# Altium project bmc-27.PrjPcb
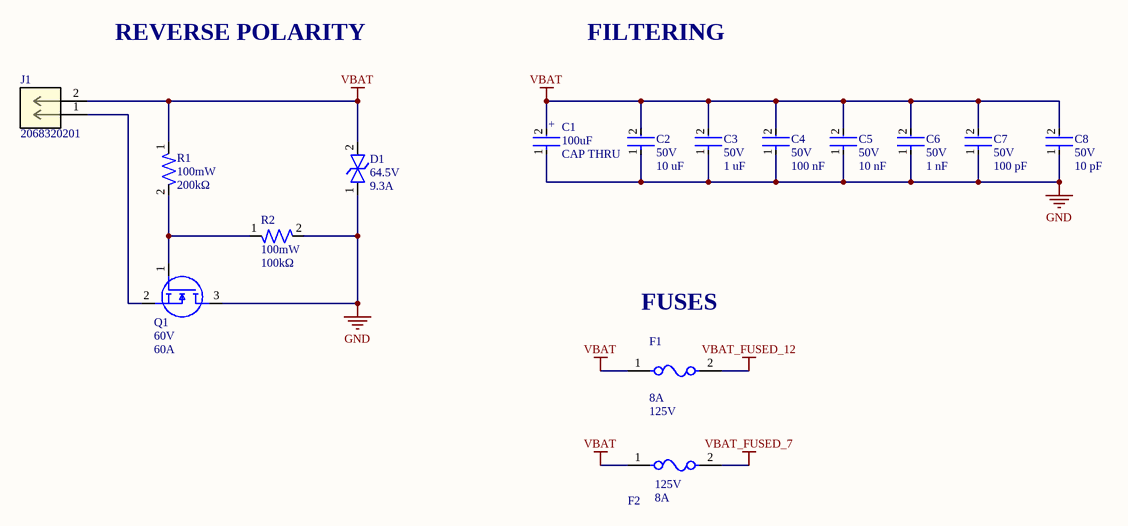
[diagram p0: Input Power.SchDoc]
7 sheets, 184 parts. Net scope: flat (ports and power ports of the same name join across sheets).
Sheets:
  Input Power.SchDoc
  Motor Control.SchDoc
  12V Buck.SchDoc
  7V Buck.SchDoc
  LDOs.SchDoc
  MCU.SchDoc
  CAN.SchDoc

## Sheet Input Power.SchDoc
size A; SheetNumber: 1; SheetTotal: 5

### Parts
C1  CAP THRU  value 100uF  [WCAP-ATUL_8X11.5(DXL)]
C2  Voltage Rating: 50V  Capacitance: 10 uF  [CAP-1210]  (hidden comment: CAP 1210)
C3  Voltage Rating: 50V  Capacitance: 1 uF  [CAP-1210]  (hidden comment: CAP 1210)
C4  Voltage Rating: 50V  Capacitance: 100 nF  [CAP-1210]  (hidden comment: CAP 1210)
C5  Voltage Rating: 50V  Capacitance: 10 nF  [CAP-1210]  (hidden comment: CAP 1210)
C6  Voltage Rating: 50V  Capacitance: 1 nF  [CAP-1210]  (hidden comment: CAP 1210)
C7  Voltage Rating: 50V  Capacitance: 100 pF  [CAP-1210]  (hidden comment: CAP 1210)
C8  Voltage Rating: 50V  Capacitance: 10 pF  [CAP-1210]  (hidden comment: CAP 1210)
D1  Voltage Rating: 64.5V  Current Rating: 9.3A  [DO-214AA (SMBJ)]  (hidden comment: SMBJ40CA)
F1  Fuse Current: 8A  Voltage Rating: 125V  [FUSE-0001]  (hidden comment: 01550900M)
F2  Fuse Current: 8A  Voltage Rating: 125V  [FUSE-0001]  (hidden comment: 01550900M)
J1  2068320201  [CONN_2068320000-SD_02_MOL]
Q1  Voltage: 60V  Continuous Current: 60A  [IC-8VSONCLIP]  (hidden comment: CSD18543Q3AT)
R1  Wattage: 100mW  Resistance: 200kΩ  [RES-0805]  (hidden comment: RES 0805)
R2  Wattage: 100mW  Resistance: 100kΩ  [RES-0805]  (hidden comment: RES 0805)

### Nets
GND: C1.1 C2.1 C3.1 C4.1 C5.1 C6.1 C7.1 C8.1 D1.1 Q1.3(D) R2.2
VBAT: C1.2 C2.2 C3.2 C4.2 C5.2 C6.2 C7.2 C8.2 D1.2 F1.1 F2.1 J1.2 R1.1
VBAT_FUSED_7: F2.2
VBAT_FUSED_12: F1.2
NetJ1_1: J1.1 Q1.2(S)
NetQ1_1: Q1.1(G) R1.2 R2.1

### Notes on the sheet
- REVERSE POLARITY
- FILTERING
- FUSES
- (in symbol CAP THRU) +

### Library data of the parts
C1 = CAP THRU: MF: {'manufacturer': u'W\xfcrth Elektronik'}; MP: 860040674004; Package: None; Price: None; Availability: Unavailable
D1 = DIO-TVS-0001: TVS DIODE 40VWM 64.5VC DO214AA; ComponentLink1Description: Datasheet; ComponentLink1URL: https://www.littelfuse.com/media?resourcetype=datasheets&itemid=09a6ae9a-73cb-4ac4-acac-e6dab92ab953&filename=littelfuse_tvs_diode_smbj_datasheet.pdf
F1 = FUSE-0001: FUSE BLOK CARTRIDGE 125V 10A SMD; ComponentLink2Description: Datasheet; ComponentLink2URL: https://www.littelfuse.com/~/media/electronics/datasheets/fuses/littelfuse_fuse_154_154t_154l_154tl_datasheet.pdf.pdf
F2 = CMP-08604-000021-1: FUSE BLOK CARTRIDGE 125V 10A SMD; ComponentLink2Description: Datasheet; ComponentLink2URL: https://www.littelfuse.com/~/media/electronics/datasheets/fuses/littelfuse_fuse_154_154t_154l_154tl_datasheet.pdf.pdf
J1 = CONN MF+ 2 PIN VERT: Micro-Fit+ Vertical Header, Through Hole, 3.00mm Pitch, Dual Row, 2 Circuits, Tin (Sn) Plating, Glow-Wire Capable, Black, Tray; Manufacturer_Name: Molex Connector Corporation; Copyright: Copyright (C) 2025 Ultra Librarian. All rights reserved.; Manufacturer_Part_Number: 2068320201; RefDes: RefDes; Type: Type
Q1 = NMOS-60A-0001: MOSFET N-CH 60V 12A/60A 8VSON; ComponentLink2Description: Datasheet; ComponentLink2URL: http://www.ti.com/lit/ds/symlink/csd18543q3a.pdf

## Sheet Motor Control.SchDoc
size B; SheetNumber: 2; SheetTotal: 5
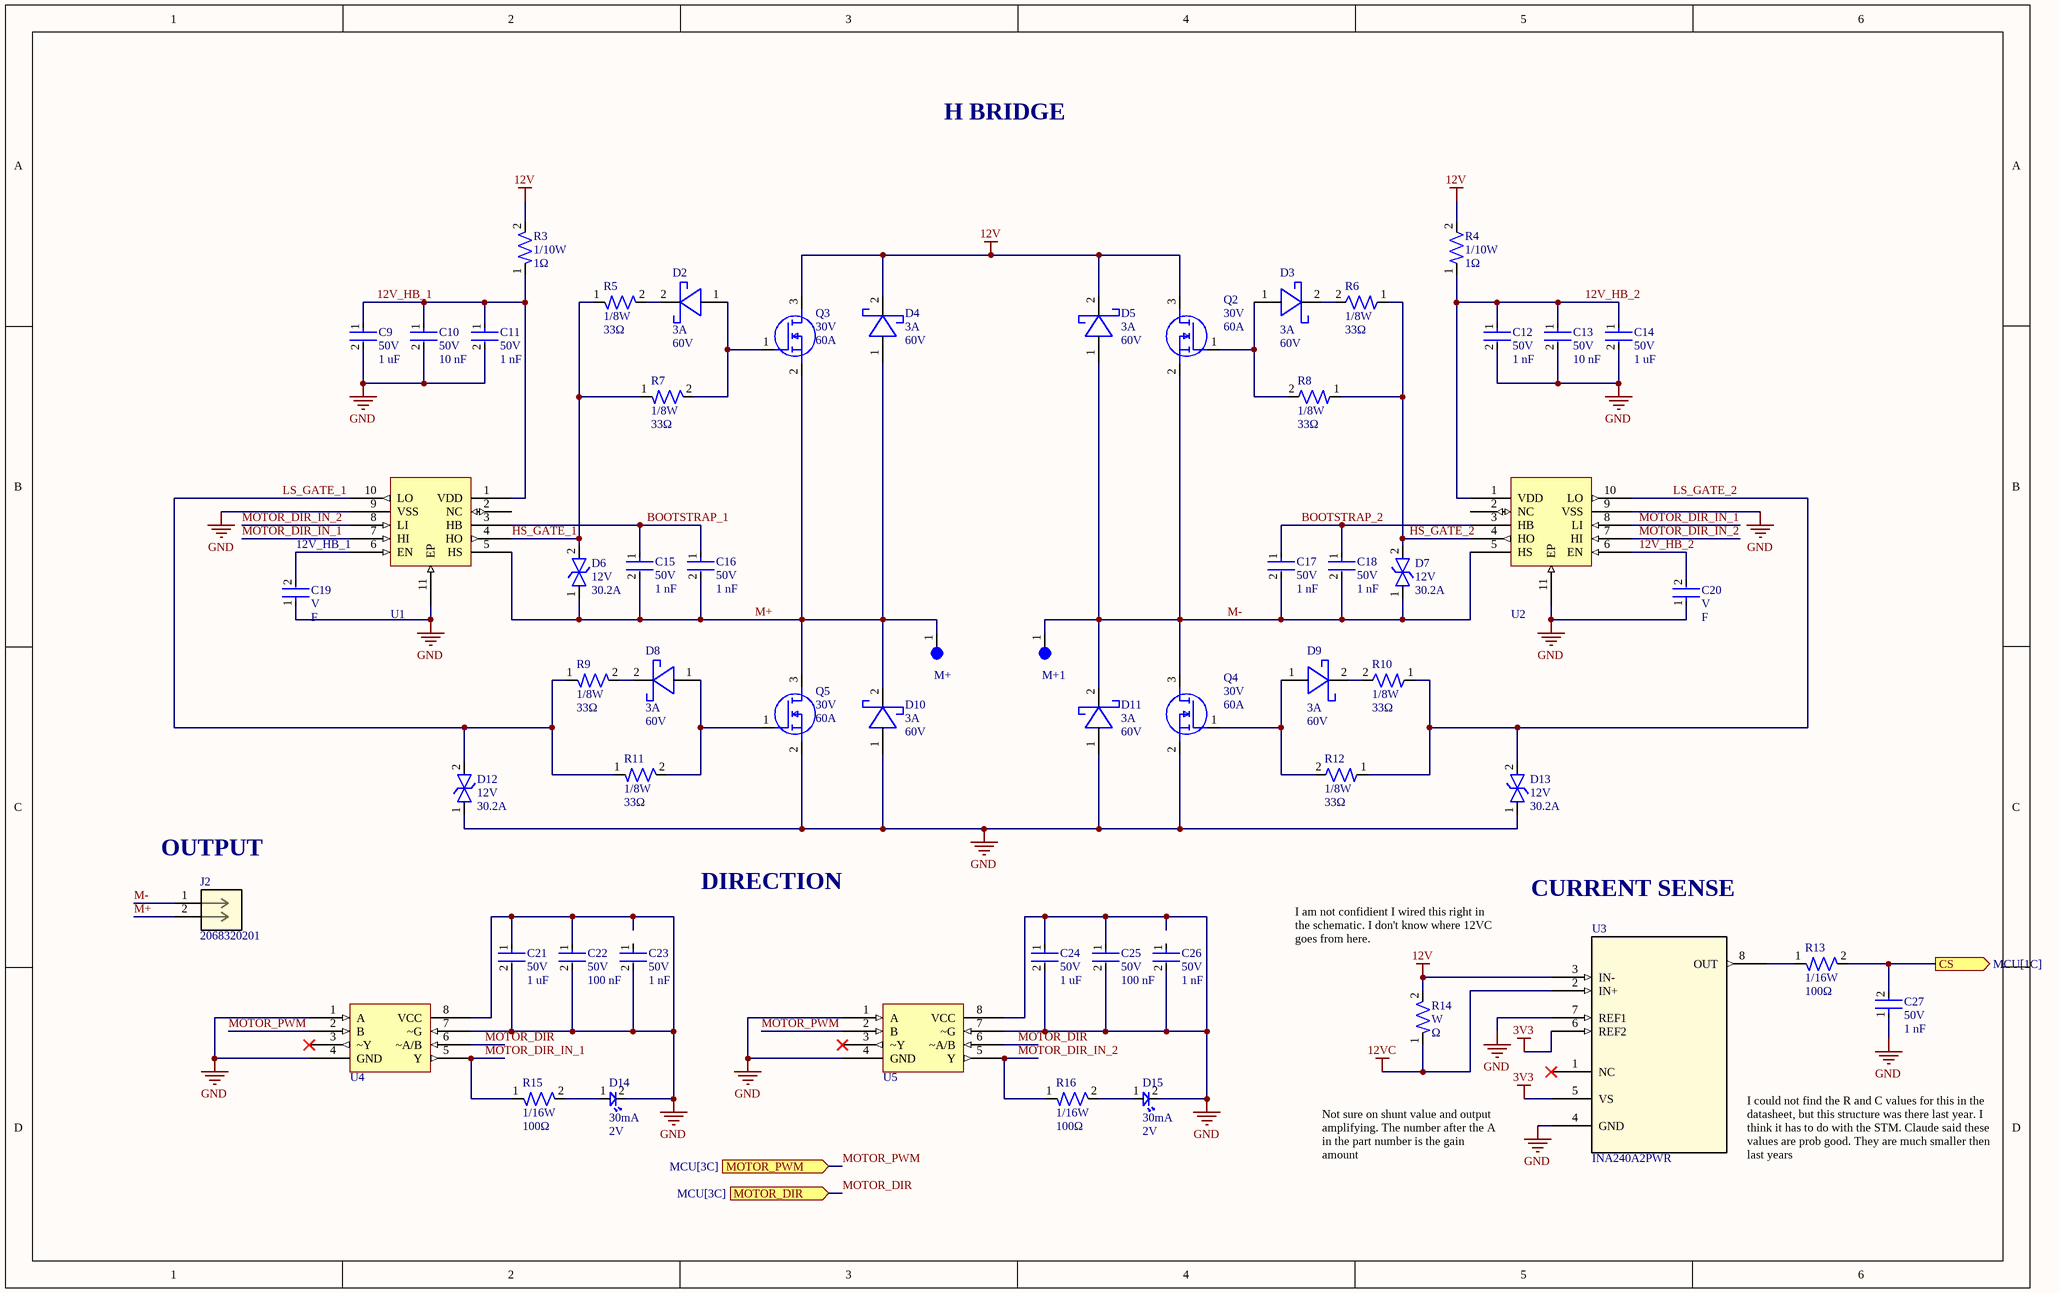
[diagram p1: Motor Control.SchDoc]

### Parts
C9  Voltage Rating: 50V  Capacitance: 1 uF  [CAP-0805]  (hidden comment: CAP 0805)
C10  Voltage Rating: 50V  Capacitance: 10 nF  [CAP-0805]  (hidden comment: CAP 0805)
C11  Voltage Rating: 50V  Capacitance: 1 nF  [CAP-0805]  (hidden comment: CAP 0805)
C12  Voltage Rating: 50V  Capacitance: 1 nF  [CAP-0805]  (hidden comment: CAP 0805)
C13  Voltage Rating: 50V  Capacitance: 10 nF  [CAP-0805]  (hidden comment: CAP 0805)
C14  Voltage Rating: 50V  Capacitance: 1 uF  [CAP-0805]  (hidden comment: CAP 0805)
C15  Voltage Rating: 50V  Capacitance: 1 nF  [CAP-0805]  (hidden comment: CAP 0805)
C16  Voltage Rating: 50V  Capacitance: 1 nF  [CAP-0805]  (hidden comment: CAP 0805)
C17  Voltage Rating: 50V  Capacitance: 1 nF  [CAP-0805]  (hidden comment: CAP 0805)
C18  Voltage Rating: 50V  Capacitance: 1 nF  [CAP-0805]  (hidden comment: CAP 0805)
C19  Voltage Rating: V  Capacitance: F  [CAP-0603]  (hidden comment: CAP 0603)
C20  Voltage Rating: V  Capacitance: F  [CAP-0603]  (hidden comment: CAP 0603)
C21  Voltage Rating: 50V  Capacitance: 1 uF  [CAP-0805]  (hidden comment: CAP 0805)
C22  Voltage Rating: 50V  Capacitance: 100 nF  [CAP-0805]  (hidden comment: CAP 0805)
C23  Voltage Rating: 50V  Capacitance: 1 nF  [CAP-0805]  (hidden comment: CAP 0805)
C24  Voltage Rating: 50V  Capacitance: 1 uF  [CAP-0805]  (hidden comment: CAP 0805)
C25  Voltage Rating: 50V  Capacitance: 100 nF  [CAP-0805]  (hidden comment: CAP 0805)
C26  Voltage Rating: 50V  Capacitance: 1 nF  [CAP-0805]  (hidden comment: CAP 0805)
C27  Voltage Rating: 50V  Capacitance: 1 nF  [CAP-0805]  (hidden comment: CAP 0805)
D2  Current Rating: 3A  Reverse Voltage: 60V  [DIO-SOD128]  (hidden comment: PMEG6030EP,115)
D3  Current Rating: 3A  Reverse Voltage: 60V  [DIO-SOD128]  (hidden comment: PMEG6030EP,115)
D4  Current Rating: 3A  Reverse Voltage: 60V  [DIO-SOD128]  (hidden comment: PMEG6030EP,115)
D5  Current Rating: 3A  Reverse Voltage: 60V  [DIO-SOD128]  (hidden comment: PMEG6030EP,115)
D6  Voltage Rating: 12V  Current Rating: 30.2A  [DO-214AA (SMBJ)]  (hidden comment: SMBJ40CA)
D7  Voltage Rating: 12V  Current Rating: 30.2A  [DO-214AA (SMBJ)]  (hidden comment: SMBJ40CA)
D8  Current Rating: 3A  Reverse Voltage: 60V  [DIO-SOD128]  (hidden comment: PMEG6030EP,115)
D9  Current Rating: 3A  Reverse Voltage: 60V  [DIO-SOD128]  (hidden comment: PMEG6030EP,115)
D10  Current Rating: 3A  Reverse Voltage: 60V  [DIO-SOD128]  (hidden comment: PMEG6030EP,115)
D11  Current Rating: 3A  Reverse Voltage: 60V  [DIO-SOD128]  (hidden comment: PMEG6030EP,115)
D12  Voltage Rating: 12V  Current Rating: 30.2A  [DO-214AA (SMBJ)]  (hidden comment: SMBJ40CA)
D13  Voltage Rating: 12V  Current Rating: 30.2A  [DO-214AA (SMBJ)]  (hidden comment: SMBJ40CA)
D14  Forward Current: 30mA  Forward Voltage: 2V  [LED-0603]  (hidden comment: BL-HKC36G-AV-TRB)
D15  Forward Current: 30mA  Forward Voltage: 2V  [LED-0603]  (hidden comment: BL-HKC36G-AV-TRB)
J2  2068320201  [CONN_2068320000-SD_02_MOL]
M+  5003  [TEST-POINT-0001]  (value not drawn)
M+1  5003  [TEST-POINT-0001]  (value not drawn)
Q2  Voltage: 30V  Continuous Current: 60A  [IC-8VSONCLIP]  (hidden comment: CSD17575Q3)
Q3  Voltage: 30V  Continuous Current: 60A  [IC-8VSONCLIP]  (hidden comment: CSD17575Q3)
Q4  Voltage: 30V  Continuous Current: 60A  [IC-8VSONCLIP]  (hidden comment: CSD17575Q3)
Q5  Voltage: 30V  Continuous Current: 60A  [IC-8VSONCLIP]  (hidden comment: CSD17575Q3)
R3  Wattage: 1/10W  Resistance: 1Ω  [RES-0805]  (hidden comment: RES 0805)
R4  Wattage: 1/10W  Resistance: 1Ω  [RES-0805]  (hidden comment: RES 0805)
R5  Wattage: 1/8W  Resistance: 33Ω  [RES-0805]  (hidden comment: RES 0805)
R6  Wattage: 1/8W  Resistance: 33Ω  [RES-0805]  (hidden comment: RES 0805)
R7  Wattage: 1/8W  Resistance: 33Ω  [RES-0805]  (hidden comment: RES 0805)
R8  Wattage: 1/8W  Resistance: 33Ω  [RES-0805]  (hidden comment: RES 0805)
R9  Wattage: 1/8W  Resistance: 33Ω  [RES-0805]  (hidden comment: RES 0805)
R10  Wattage: 1/8W  Resistance: 33Ω  [RES-0805]  (hidden comment: RES 0805)
R11  Wattage: 1/8W  Resistance: 33Ω  [RES-0805]  (hidden comment: RES 0805)
R12  Wattage: 1/8W  Resistance: 33Ω  [RES-0805]  (hidden comment: RES 0805)
R13  Wattage: 1/16W  Resistance: 100Ω  [RES-0805]  (hidden comment: RES 0805)
R14  Wattage: W  Resistance: Ω  [RES-2512]  (hidden comment: RES 2512)
R15  Wattage: 1/16W  Resistance: 100Ω  [RES-0805]  (hidden comment: RES 0805)
R16  Wattage: 1/16W  Resistance: 100Ω  [RES-0805]  (hidden comment: RES 0805)
U1  UCC27282DRCR  [IC-10VSON]  (value not drawn)
U2  UCC27282DRCR  [IC-10VSON]  (value not drawn)
U3  INA240A2PWR  [PW0008A_N_TEX]
U4  SN74LVC2G157DCUR  [IC-8VSSOP]  (value not drawn)
U5  SN74LVC2G157DCUR  [IC-8VSSOP]  (value not drawn)

### Ports
CS (out, see MCU[1C]), MOTOR_DIR (in, see MCU[3C]), MOTOR_PWM (in, see MCU[3C])

### Nets
3V3: U3.5(VS) U3.6(REF2)  [project net VDD]
12V: D4.2(ANODE) D5.2(ANODE) Q2.3(D) Q3.3(D) R3.2 R4.2 R14.2 U3.3(IN-)
12VC: R14.1 U3.2(IN+)
GND: C9.2 C10.2 C11.2 C12.2 C13.2 C14.2 C19.1 C20.1 C21.1 C21.2 C22.1 C22.2 C23.2 C24.1 C24.2 C25.1 C25.2 C26.2 C27.1 D10.1(CATHODE) D11.1(CATHODE) D12.1 D13.1 D14.2 D15.2 Q4.2(S) Q5.2(S) U1.9(VSS) U1.11(EP) U2.9(VSS) U2.11(EP) U3.4(GND) U3.7(REF1) U4.1(A) U4.4(GND) U4.7(~G) U4.8(VCC) U5.1(A) U5.4(GND) U5.7(~G) U5.8(VCC)
12V_HB_1: C9.1 C10.1 C11.1 R3.1 U1.1(VDD)
12V_HB_2: C12.1 C13.1 C14.1 C20.2 R4.1 U2.1(VDD) U2.6(EN)
BOOTSTRAP_1: C15.1 C16.1 U1.3(HB)
BOOTSTRAP_2: C17.1 C18.1 U2.3(HB)
CS: C27.2 R13.2 ; port CS
HS_GATE_1: D6.2 R5.1 R7.1 U1.4(HO)
HS_GATE_2: D7.2 R6.1 R8.1 U2.4(HO)
LS_GATE_1: D12.2 R9.1 R11.1 U1.10(LO)
LS_GATE_2: D13.2 R10.1 R12.1 U2.10(LO)
M+: C15.2 C16.2 D4.1(CATHODE) D6.1 D10.2(ANODE) J2.2 M+.1 Q3.2(S) Q5.3(D) U1.5(HS)
M-: C17.2 C18.2 D5.1(CATHODE) D7.1 D11.2(ANODE) J2.1 M+1.1 Q2.2(S) Q4.3(D) U2.5(HS)
MOTOR_DIR: U4.6(~A/B) U5.6(~A/B) ; port MOTOR_DIR
MOTOR_DIR_IN_1: R15.1 U1.7(HI) U2.8(LI) U4.5(Y)
MOTOR_DIR_IN_2: R16.1 U1.8(LI) U2.7(HI) U5.5(Y)
MOTOR_PWM: U4.2(B) U5.2(B) ; port MOTOR_PWM
NetC19_2: C19.2 U1.6(EN)
NetD2_1: D2.1(CATHODE) Q3.1(G) R7.2
NetD2_2: D2.2(ANODE) R5.2
NetD3_1: D3.1(CATHODE) Q2.1(G) R8.2
NetD3_2: D3.2(ANODE) R6.2
NetD8_1: D8.1(CATHODE) Q5.1(G) R11.2
NetD8_2: D8.2(ANODE) R9.2
NetD9_1: D9.1(CATHODE) Q4.1(G) R12.2
NetD9_2: D9.2(ANODE) R10.2
NetD14_1: D14.1 R15.2
NetD15_1: D15.1 R16.2
NetR13_1: R13.1 U3.8(OUT)

Not connected (* = marked no-connect by the designer): C23 1; C26 1; U1 2(NC); U2 2(NC); U3 1(NC)*; U4 3(~Y)*; U5 3(~Y)*

### Notes on the sheet
- H BRIDGE
- 12V_HB_1
- (near J2) OUTPUT
- DIRECTION
- CURRENT SENSE
- (near R14) I am not confidient I wired this right in the schematic. I don't know where 12VC goes from here.
- Not sure on shunt value and output amplifying. The number after the A in the part number is the gain amount
- (near U3) I could not find the R and C values for this in the datasheet, but this structure was there last year. I think it has to do with the STM. Claude said these values are prob good. They are much smaller then last years

### Library data of the parts
D2-D5 D8-D11 = DIO-SCHOTTKY-0003: DIODE SCHOTTKY 60V 3A SOD128; ComponentLink1Description: Datasheet; ComponentLink1URL: https://assets.nexperia.com/documents/data-sheet/PMEG6030EP.pdf
D6 D7 D12 D13 = DIO-TVS-0001: TVS DIODE 40VWM 64.5VC DO214AA; ComponentLink1Description: Datasheet; ComponentLink1URL: https://www.littelfuse.com/media?resourcetype=datasheets&itemid=09a6ae9a-73cb-4ac4-acac-e6dab92ab953&filename=littelfuse_tvs_diode_smbj_datasheet.pdf
D14 D15 = LED-0001: LED YELLOW CLEAR 0603 SMD; ComponentLink1Description: Datasheet; ComponentLink1URL: https://www.americanbrightled.com/pdffiles/led-components/smt/BL-HKC36G-AV-TRB.pdf
J2 = CONN MF+ 2 PIN VERT: as J1 on sheet Input Power; Copyright: Copyright (C) 2025 Ultra Librarian. All rights reserved.; Manufacturer_Part_Number: 2068320201; RefDes: RefDes; Type: Type
M+ M+1 = TEST-POINT-0001: Oranange PC Test Point, Miniature Phoisphor Bronze Silver Plating Through Hole Mounting Type
Q2-Q5 = NMOS-26A-0001: MOSFET N-CH 30V 60A 8VSON; ComponentLink1Description: Datasheet; ComponentLink1URL: https://www.ti.com/lit/ds/symlink/csd17575q3.pdf?ts=1728565072242&ref_url=https%253A%252F%252Fwww.mouser.co.uk%252F
U1 U2 = IC-GTDR-0001: IC GATE DRVR HALF-BRIDGE 10VSON; VCC Max: 16; Package: 10-VSON; ComponentLink1Description: Datasheet; ComponentLink1URL: https://www.ti.com/lit/ds/symlink/ucc27282.pdf?HQS=dis-dk-null-digikeymode-dsf-pf-null-wwe&ts=1728563165008&ref_url=https%253A%252F%252Fwww.ti.com
U3 = INA240A2PWR: -4 to 80V, bidirectional, ultra-precise current sense amplifier with enhanced PWM rejection 8-TSSOP -40 to 125; Manufacturer_Name: Texas Instruments; Copyright: Copyright (C) 2026 Ultra Librarian. All rights reserved.; Manufacturer_Part_Number: INA240A2PWR; RefDes: RefDes; Type: Type
U4 U5 = IC-MUX-0001: Multiplexer 1 x 2:1 8-VSSOP; ComponentLink1Description: Datasheet; ComponentLink1URL: https://www.ti.com/general/docs/suppproductinfo.tsp?distId=10&gotoUrl=https%3A%2F%2Fwww.ti.com%2Flit%2Fgpn%2Fsn74lvc2g157

## Sheet 12V Buck.SchDoc
size B; SheetNumber: 3; SheetTotal: 7
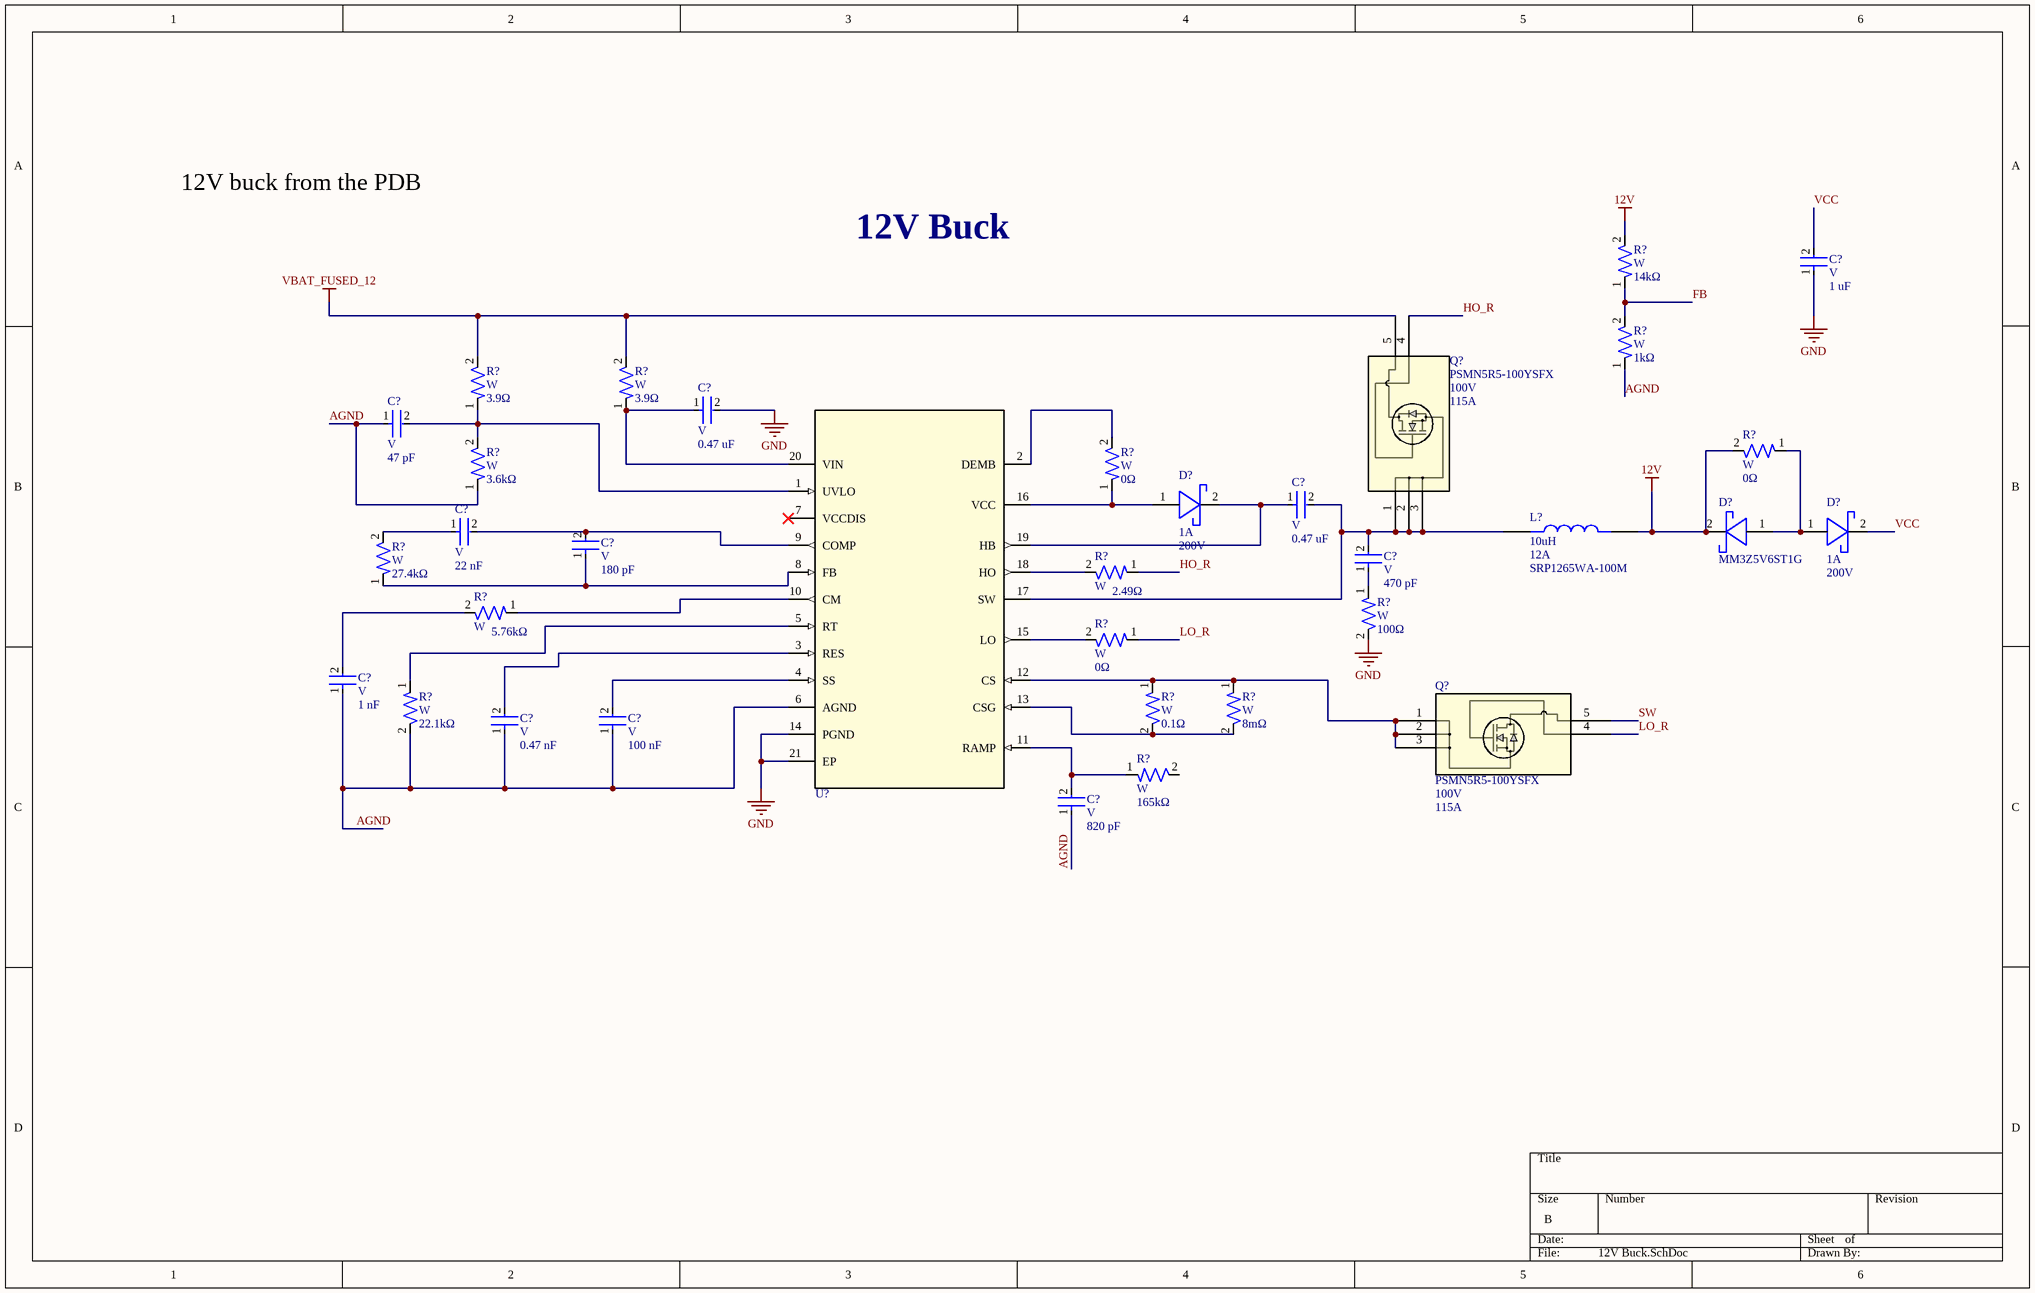
[diagram p2: 12V Buck.SchDoc]

### Parts
(Parts that share a designator on the sheet are numbered #1, #2 ... from top to bottom, then left to right.)
C?#1  Voltage Rating: V  Capacitance: 1 uF  [CAP-0805]  (hidden comment: CAP 0805)
C?#2  Voltage Rating: V  Capacitance: 0.47 uF  [CAP-0805]  (hidden comment: CAP 0805)
C?#3  Voltage Rating: V  Capacitance: 47 pF  [CAP-0805]  (hidden comment: CAP 0805)
C?#4  Voltage Rating: V  Capacitance: 0.47 uF  [CAP-0805]  (hidden comment: CAP 0805)
C?#5  Voltage Rating: V  Capacitance: 22 nF  [CAP-0805]  (hidden comment: CAP 0805)
C?#6  Voltage Rating: V  Capacitance: 180 pF  [CAP-0805]  (hidden comment: CAP 0805)
C?#7  Voltage Rating: V  Capacitance: 470 pF  [CAP-0805]  (hidden comment: CAP 0805)
C?#8  Voltage Rating: V  Capacitance: 1 nF  [CAP-0805]  (hidden comment: CAP 0805)
C?#9  Voltage Rating: V  Capacitance: 0.47 nF  [CAP-0805]  (hidden comment: CAP 0805)
C?#10  Voltage Rating: V  Capacitance: 100 nF  [CAP-0805]  (hidden comment: CAP 0805)
C?#11  Voltage Rating: V  Capacitance: 820 pF  [CAP-0805]  (hidden comment: CAP 0805)
D?#1  Current Rating: 1A  Reverse Voltage: 200V  [SMA_DIO]  (hidden comment: SS1200)
D?#2  MM3Z5V6ST1G  [DIO_MM3Z3V0T1G - duplicate]
D?#3  Current Rating: 1A  Reverse Voltage: 200V  [SMA_DIO]  (hidden comment: SS1200)
L?#1  SRP1265WA-100M  value 10uH  Current: 12A  [IND_SRP1265_BRN]
Q?#1  PSMN5R5-100YSFX  Vdss: 100V  Drain Current: 115A  [LFPAK_SOT669_NEX]
Q?#2  PSMN5R5-100YSFX  Vdss: 100V  Drain Current: 115A  [LFPAK_SOT669_NEX]
R?#1  Wattage: W  Resistance: 14kΩ  [RES-0805]  (hidden comment: RES 0805)
R?#2  Wattage: W  Resistance: 1kΩ  [RES-0805]  (hidden comment: RES 0805)
R?#3  Wattage: W  Resistance: 3.9Ω  [RES-0805]  (hidden comment: RES 0805)
R?#4  Wattage: W  Resistance: 3.9Ω  [RES-0805]  (hidden comment: RES 0805)
R?#5  Wattage: W  Resistance: 0Ω  [RES-0805]  (hidden comment: RES 0805)
R?#6  Wattage: W  Resistance: 3.6kΩ  [RES-0805]  (hidden comment: RES 0805)
R?#7  Wattage: W  Resistance: 0Ω  [RES-0805]  (hidden comment: RES 0805)
R?#8  Wattage: W  Resistance: 27.4kΩ  [RES-0805]  (hidden comment: RES 0805)
R?#9  Wattage: W  Resistance: 2.49Ω  [RES-0805]  (hidden comment: RES 0805)
R?#10  Wattage: W  Resistance: 5.76kΩ  [RES-0805]  (hidden comment: RES 0805)
R?#11  Wattage: W  Resistance: 100Ω  [RES-0805]  (hidden comment: RES 0805)
R?#12  Wattage: W  Resistance: 0Ω  [RES-0805]  (hidden comment: RES 0805)
R?#13  Wattage: W  Resistance: 22.1kΩ  [RES-0805]  (hidden comment: RES 0805)
R?#14  Wattage: W  Resistance: 0.1Ω  [RES-0805]  (hidden comment: RES 0805)
R?#15  Wattage: W  Resistance: 8mΩ  [RES-0805]  (hidden comment: RES 0805)
R?#16  Wattage: W  Resistance: 165kΩ  [RES-0805]  (hidden comment: RES 0805)
U?#1  LM5117PMHX/NOPB  [IC-20-HTSSOP]  (value not drawn)

### Nets
12V: D?#2.2 L?#1.2 R?#1.2 R?#5.2
GND: C?#1.1 C?#2.2 R?#11.2 U?#1.14(PGND) U?#1.21(EP)
VBAT_FUSED_12: Q?#1.5 R?#3.2 R?#4.2
AGND: C?#3.1 C?#8.1 C?#9.1 C?#10.1 C?#11.1 R?#2.1 R?#6.1 R?#13.2 U?#1.6(AGND)
FB: R?#1.1 R?#2.2
HO_R: Q?#1.4 R?#9.1
LO_R: Q?#2.4 R?#12.1
SW: Q?#2.5
VCC: C?#1.2 D?#3.2(ANODE)
NetC?#2_1: C?#2.1 R?#4.1 U?#1.20(VIN)
NetC?#3_2: C?#3.2 R?#3.1 R?#6.2 U?#1.1(UVLO)
NetC?#4_1: C?#4.1 D?#1.2(ANODE) U?#1.19(HB)
NetC?#4_2: C?#4.2 C?#7.2 L?#1.1 Q?#1.1 Q?#1.2 Q?#1.3 U?#1.17(SW)
NetC?#5_1: C?#5.1 R?#8.2
NetC?#5_2: C?#5.2 C?#6.2 U?#1.9(COMP)
NetC?#6_1: C?#6.1 R?#8.1 U?#1.8(FB)
NetC?#7_1: C?#7.1 R?#11.1
NetC?#8_2: C?#8.2 R?#10.2
NetC?#9_2: C?#9.2 U?#1.3(RES)
NetC?#10_2: C?#10.2 U?#1.4(SS)
NetC?#11_2: C?#11.2 R?#16.1 U?#1.11(RAMP)
NetD?#1_1: D?#1.1(CATHODE) R?#7.1 U?#1.16(VCC)
NetD?#2_1: D?#2.1 D?#3.1(CATHODE) R?#5.1
NetQ?#2_1: Q?#2.1 Q?#2.2 Q?#2.3 R?#14.1 R?#15.1 U?#1.12(CS)
NetR?#7_2: R?#7.2 U?#1.2(DEMB)
NetR?#9_2: R?#9.2 U?#1.18(HO)
NetR?#10_1: R?#10.1 U?#1.10(CM)
NetR?#12_2: R?#12.2 U?#1.15(LO)
NetR?#13_1: R?#13.1 U?#1.5(RT)
NetR?#14_2: R?#14.2 R?#15.2 U?#1.13(CSG)

Not connected (* = marked no-connect by the designer): R?#16 2; U?#1 7(VCCDIS)*

### Notes on the sheet
- 12V buck from the PDB
- 12V Buck

### Library data of the parts
D?#1 D?#3 = DIO-SCHOTTKY-0004: DIODE SCHOTTKY 200V 1A SMA; ComponentLink1Description: Datasheet; ComponentLink1URL: https://www.digikey.com/en/products/detail/mdd/ss1200/15911596
D?#2 = TESTDIOZ
L?#1 = IND-10U-0002: 10 µH Shielded Inductor 12 A 16.5mOhm Max Nonstandard; MP: SRP1265A-100M; Package: None; Price: None; Availability: Unavailable
Q?#1 Q?#2 = NMOS-115A-0001: N-Channel 100 V 115A (Tc) 238W (Tc) Surface Mount LFPAK56, Power-SO8; Manufacturer_Part_Number: TPH2R506PL; Vgs (max): 20V; Vgs: 4V @ 1mA; RefDes: RefDes
U?#1 = IC-BUCK-0011: Buck Regulator Positive Output Step-Down DC-DC Controller IC 20-HTSSOP; Manufacturer Part Number: TPS62933ODRLR; Manufacturer: Texas Instruments; Assembled?: no; Type: Buck

## Sheet 7V Buck.SchDoc
size B; SheetNumber: 3; SheetTotal: 6
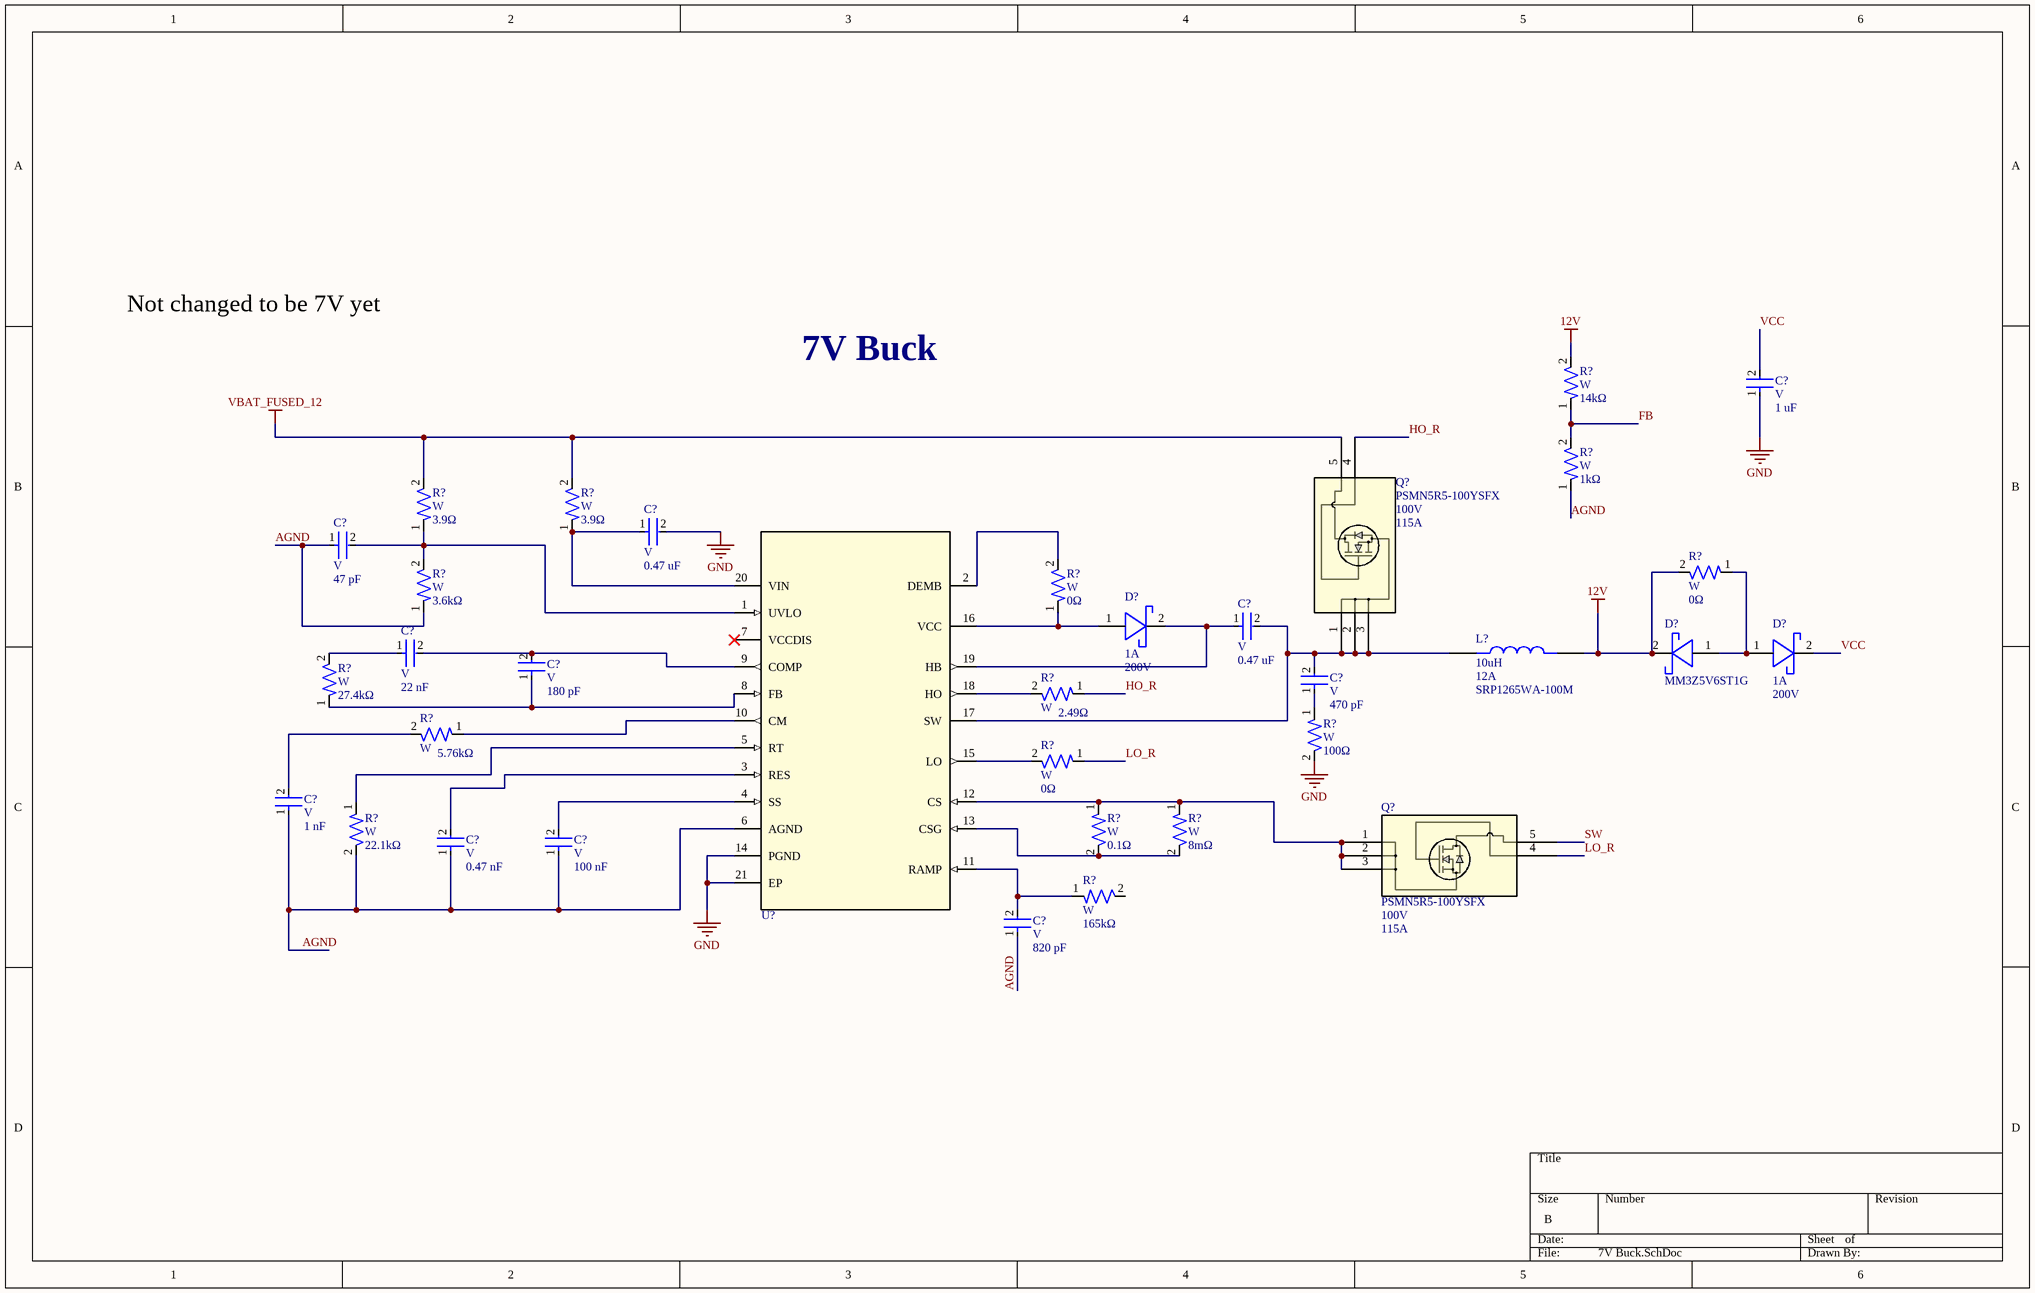
[diagram p3: 7V Buck.SchDoc]

### Parts
(Parts that share a designator on the sheet are numbered #1, #2 ... from top to bottom, then left to right.)
C?#12  Voltage Rating: V  Capacitance: 1 uF  [CAP-0805]  (hidden comment: CAP 0805)
C?#13  Voltage Rating: V  Capacitance: 0.47 uF  [CAP-0805]  (hidden comment: CAP 0805)
C?#14  Voltage Rating: V  Capacitance: 47 pF  [CAP-0805]  (hidden comment: CAP 0805)
C?#15  Voltage Rating: V  Capacitance: 0.47 uF  [CAP-0805]  (hidden comment: CAP 0805)
C?#16  Voltage Rating: V  Capacitance: 22 nF  [CAP-0805]  (hidden comment: CAP 0805)
C?#17  Voltage Rating: V  Capacitance: 180 pF  [CAP-0805]  (hidden comment: CAP 0805)
C?#18  Voltage Rating: V  Capacitance: 470 pF  [CAP-0805]  (hidden comment: CAP 0805)
C?#19  Voltage Rating: V  Capacitance: 1 nF  [CAP-0805]  (hidden comment: CAP 0805)
C?#20  Voltage Rating: V  Capacitance: 0.47 nF  [CAP-0805]  (hidden comment: CAP 0805)
C?#21  Voltage Rating: V  Capacitance: 100 nF  [CAP-0805]  (hidden comment: CAP 0805)
C?#22  Voltage Rating: V  Capacitance: 820 pF  [CAP-0805]  (hidden comment: CAP 0805)
D?#4  Current Rating: 1A  Reverse Voltage: 200V  [SMA_DIO]  (hidden comment: SS1200)
D?#5  MM3Z5V6ST1G  [DIO_MM3Z3V0T1G - duplicate]
D?#6  Current Rating: 1A  Reverse Voltage: 200V  [SMA_DIO]  (hidden comment: SS1200)
L?#2  SRP1265WA-100M  value 10uH  Current: 12A  [IND_SRP1265_BRN]
Q?#3  PSMN5R5-100YSFX  Vdss: 100V  Drain Current: 115A  [LFPAK_SOT669_NEX]
Q?#4  PSMN5R5-100YSFX  Vdss: 100V  Drain Current: 115A  [LFPAK_SOT669_NEX]
R?#17  Wattage: W  Resistance: 14kΩ  [RES-0805]  (hidden comment: RES 0805)
R?#18  Wattage: W  Resistance: 1kΩ  [RES-0805]  (hidden comment: RES 0805)
R?#19  Wattage: W  Resistance: 3.9Ω  [RES-0805]  (hidden comment: RES 0805)
R?#20  Wattage: W  Resistance: 3.9Ω  [RES-0805]  (hidden comment: RES 0805)
R?#21  Wattage: W  Resistance: 0Ω  [RES-0805]  (hidden comment: RES 0805)
R?#22  Wattage: W  Resistance: 3.6kΩ  [RES-0805]  (hidden comment: RES 0805)
R?#23  Wattage: W  Resistance: 0Ω  [RES-0805]  (hidden comment: RES 0805)
R?#24  Wattage: W  Resistance: 27.4kΩ  [RES-0805]  (hidden comment: RES 0805)
R?#25  Wattage: W  Resistance: 2.49Ω  [RES-0805]  (hidden comment: RES 0805)
R?#26  Wattage: W  Resistance: 5.76kΩ  [RES-0805]  (hidden comment: RES 0805)
R?#27  Wattage: W  Resistance: 100Ω  [RES-0805]  (hidden comment: RES 0805)
R?#28  Wattage: W  Resistance: 0Ω  [RES-0805]  (hidden comment: RES 0805)
R?#29  Wattage: W  Resistance: 22.1kΩ  [RES-0805]  (hidden comment: RES 0805)
R?#30  Wattage: W  Resistance: 0.1Ω  [RES-0805]  (hidden comment: RES 0805)
R?#31  Wattage: W  Resistance: 8mΩ  [RES-0805]  (hidden comment: RES 0805)
R?#32  Wattage: W  Resistance: 165kΩ  [RES-0805]  (hidden comment: RES 0805)
U?#2  LM5117PMHX/NOPB  [IC-20-HTSSOP]  (value not drawn)

### Nets
12V: D?#5.2 L?#2.2 R?#17.2 R?#21.2
GND: C?#12.1 C?#13.2 R?#27.2 U?#2.14(PGND) U?#2.21(EP)
VBAT_FUSED_12: Q?#3.5 R?#19.2 R?#20.2
AGND: C?#14.1 C?#19.1 C?#20.1 C?#21.1 C?#22.1 R?#18.1 R?#22.1 R?#29.2 U?#2.6(AGND)
FB: R?#17.1 R?#18.2
HO_R: Q?#3.4 R?#25.1
LO_R: Q?#4.4 R?#28.1
SW: Q?#4.5
VCC: C?#12.2 D?#6.2(ANODE)
NetC?#13_1: C?#13.1 R?#20.1 U?#2.20(VIN)
NetC?#14_2: C?#14.2 R?#19.1 R?#22.2 U?#2.1(UVLO)
NetC?#15_1: C?#15.1 D?#4.2(ANODE) U?#2.19(HB)
NetC?#15_2: C?#15.2 C?#18.2 L?#2.1 Q?#3.1 Q?#3.2 Q?#3.3 U?#2.17(SW)
NetC?#16_1: C?#16.1 R?#24.2
NetC?#16_2: C?#16.2 C?#17.2 U?#2.9(COMP)
NetC?#17_1: C?#17.1 R?#24.1 U?#2.8(FB)
NetC?#18_1: C?#18.1 R?#27.1
NetC?#19_2: C?#19.2 R?#26.2
NetC?#20_2: C?#20.2 U?#2.3(RES)
NetC?#21_2: C?#21.2 U?#2.4(SS)
NetC?#22_2: C?#22.2 R?#32.1 U?#2.11(RAMP)
NetD?#4_1: D?#4.1(CATHODE) R?#23.1 U?#2.16(VCC)
NetD?#5_1: D?#5.1 D?#6.1(CATHODE) R?#21.1
NetQ?#4_1: Q?#4.1 Q?#4.2 Q?#4.3 R?#30.1 R?#31.1 U?#2.12(CS)
NetR?#23_2: R?#23.2 U?#2.2(DEMB)
NetR?#25_2: R?#25.2 U?#2.18(HO)
NetR?#26_1: R?#26.1 U?#2.10(CM)
NetR?#28_2: R?#28.2 U?#2.15(LO)
NetR?#29_1: R?#29.1 U?#2.5(RT)
NetR?#30_2: R?#30.2 R?#31.2 U?#2.13(CSG)

Not connected (* = marked no-connect by the designer): R?#32 2; U?#2 7(VCCDIS)*

### Notes on the sheet
- Not changed to be 7V yet
- 7V Buck

### Library data of the parts
D?#4 D?#6 = DIO-SCHOTTKY-0004: DIODE SCHOTTKY 200V 1A SMA; ComponentLink1Description: Datasheet; ComponentLink1URL: https://www.digikey.com/en/products/detail/mdd/ss1200/15911596
D?#5 = TESTDIOZ
L?#2 = IND-10U-0002: as L?#1 on sheet 12V Buck; Package: None; Price: None; Availability: Unavailable
Q?#3 Q?#4 = NMOS-115A-0001: as Q?#1 on sheet 12V Buck; RefDes: RefDes
U?#2 = IC-BUCK-0011: as U?#1 on sheet 12V Buck; Type: Buck

## Sheet LDOs.SchDoc
size A; SheetNumber: 7; SheetTotal: 7
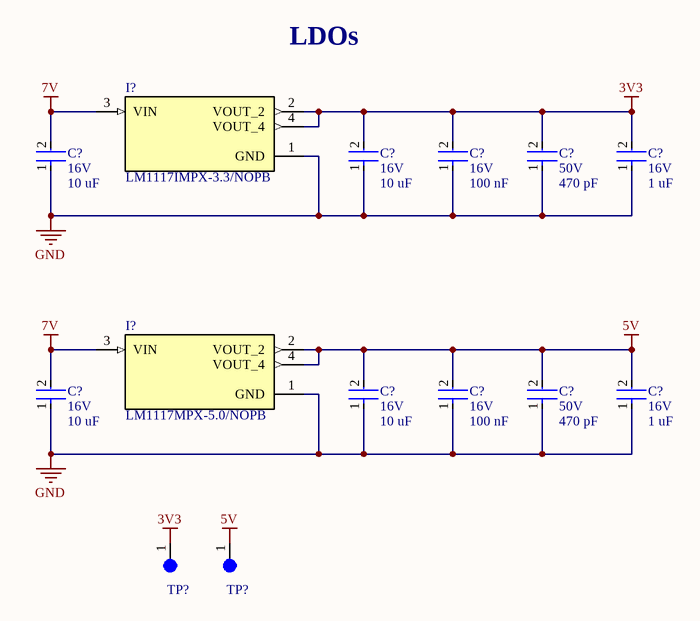
[diagram p4: LDOs.SchDoc]

### Parts
(Parts that share a designator on the sheet are numbered #1, #2 ... from top to bottom, then left to right.)
C?#23  Voltage Rating: 16V  Capacitance: 10 uF  [CAP-0805]  (hidden comment: CAP 0805)
C?#24  Voltage Rating: 16V  Capacitance: 10 uF  [CAP-0805]  (hidden comment: CAP 0805)
C?#25  Voltage Rating: 16V  Capacitance: 100 nF  [CAP-0805]  (hidden comment: CAP 0805)
C?#26  Voltage Rating: 50V  Capacitance: 470 pF  [CAP-0805]  (hidden comment: CAP 0805)
C?#27  Voltage Rating: 16V  Capacitance: 1 uF  [CAP-0805]  (hidden comment: CAP 0805)
C?#28  Voltage Rating: 16V  Capacitance: 10 uF  [CAP-0805]  (hidden comment: CAP 0805)
C?#29  Voltage Rating: 16V  Capacitance: 10 uF  [CAP-0805]  (hidden comment: CAP 0805)
C?#30  Voltage Rating: 16V  Capacitance: 100 nF  [CAP-0805]  (hidden comment: CAP 0805)
C?#31  Voltage Rating: 50V  Capacitance: 470 pF  [CAP-0805]  (hidden comment: CAP 0805)
C?#32  Voltage Rating: 16V  Capacitance: 1 uF  [CAP-0805]  (hidden comment: CAP 0805)
I?#1  LM1117IMPX-3.3/NOPB  [IC-SOT-223-4]
I?#2  LM1117MPX-5.0/NOPB  [IC-SOT-223-4]
TP?#1  5003  [TEST-POINT-0001]  (value not drawn)
TP?#2  5003  [TEST-POINT-0001]  (value not drawn)

### Nets
3V3: C?#24.2 C?#25.2 C?#26.2 C?#27.2 I?#1.2(VOUT_2) I?#1.4(VOUT_4) TP?#1.1  [project net VDD]
5V: C?#29.2 C?#30.2 C?#31.2 C?#32.2 I?#2.2(VOUT_2) I?#2.4(VOUT_4) TP?#2.1
7V: C?#23.2 C?#28.2 I?#1.3(VIN) I?#2.3(VIN)
GND: C?#23.1 C?#24.1 C?#25.1 C?#26.1 C?#27.1 C?#28.1 C?#29.1 C?#30.1 C?#31.1 C?#32.1 I?#1.1(GND) I?#2.1(GND)

### Notes on the sheet
- LDOs

### Library data of the parts
I?#1 = IC_LDO_3V3_0001: IC REG LIN 3.3V 800MA SOT223-4; ComponentLink1Description: New link; ComponentLink1URL: https://www.ti.com/lit/ds/symlink/lm1117.pdf?HQS=dis-dk-null-digikeymode-dsf-pf-null-wwe&ts=1721700739746
I?#2 = IC_LDO_5V_0001: IC REG LINEAR 5V 800MA SOT223-4; ComponentLink1Description: Datasheet; ComponentLink1URL: https://www.ti.com/lit/ds/symlink/lm1117.pdf?HQS=dis-dk-null-digikeymode-dsf-pf-null-wwe&ts=1721700739746
TP?#1 TP?#2 = TEST-POINT-0001: as M+ on sheet Motor Control

## Sheet MCU.SchDoc
size A; SheetNumber: 4; SheetTotal: 5
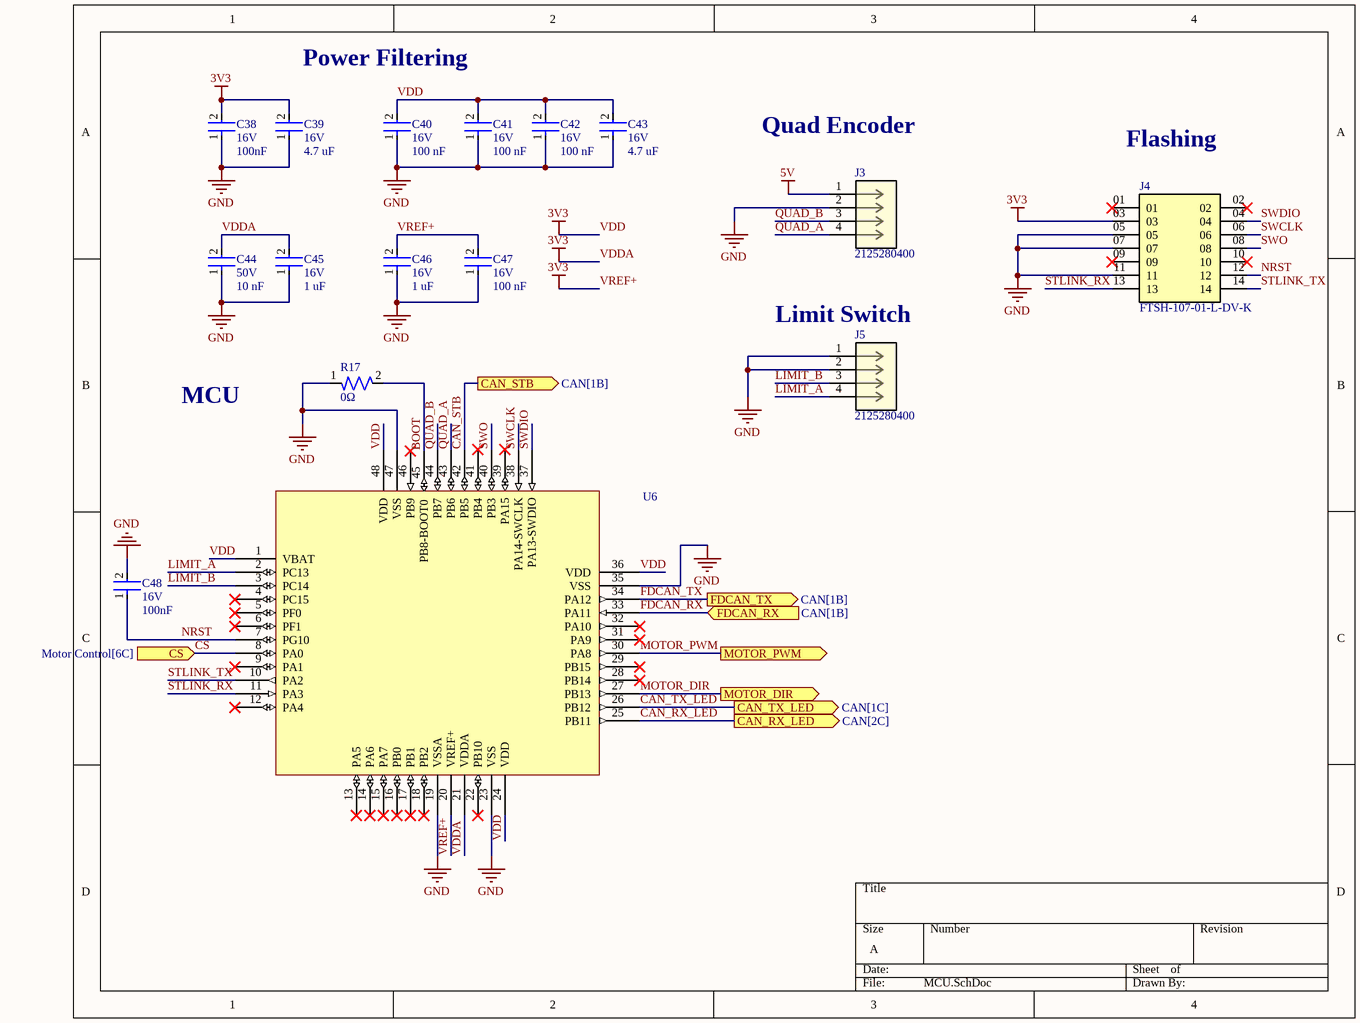
[diagram p5: MCU.SchDoc]

### Parts
C38  Voltage Rating: 16V  Capacitance: 100nF  [CAP-0805]  (hidden comment: CAP 0805)
C39  Voltage Rating: 16V  Capacitance: 4.7 uF  [CAP-0805]  (hidden comment: CAP 0805)
C40  Voltage Rating: 16V  Capacitance: 100 nF  [CAP-0805]  (hidden comment: CAP 0805)
C41  Voltage Rating: 16V  Capacitance: 100 nF  [CAP-0805]  (hidden comment: CAP 0805)
C42  Voltage Rating: 16V  Capacitance: 100 nF  [CAP-0805]  (hidden comment: CAP 0805)
C43  Voltage Rating: 16V  Capacitance: 4.7 uF  [CAP-0805]  (hidden comment: CAP 0805)
C44  Voltage Rating: 50V  Capacitance: 10 nF  [CAP-0805]  (hidden comment: CAP 0805)
C45  Voltage Rating: 16V  Capacitance: 1 uF  [CAP-0805]  (hidden comment: CAP 0805)
C46  Voltage Rating: 16V  Capacitance: 1 uF  [CAP-0805]  (hidden comment: CAP 0805)
C47  Voltage Rating: 16V  Capacitance: 100 nF  [CAP-0805]  (hidden comment: CAP 0805)
C48  Voltage Rating: 16V  Capacitance: 100nF  [CAP-0805]  (hidden comment: CAP 0805)
J3  2125280400  [CONN_2125280000_04_MOL]
J4  FTSH-107-01-L-DV-K  [SAMTEC_FTSH-107-01-L-DV-K]
J5  2125280400  [CONN_2125280000_04_MOL]
R17  Resistance: 0Ω  [RES-2010]  (hidden comment: CRF2010-J/-000ELF)
U6  STM32G431CBT6  [IC-LQFP48]  (value not drawn)

### Ports
CAN_RX_LED (out, see CAN[2C]), CAN_STB (out, see CAN[1B]), CAN_TX_LED (out, see CAN[1C]), CS (in, see Motor Control[6C]), FDCAN_RX (in, see CAN[1B]), FDCAN_TX (out, see CAN[1B]), MOTOR_DIR (out), MOTOR_PWM (out)

### Nets
5V: J3.1
GND: C38.1 C39.1 C40.1 C41.1 C42.1 C43.1 C44.1 C45.1 C46.1 C47.1 C48.2 J3.2 J4.05 J4.07 J4.11 J5.1 J5.2 R17.1 U6.19(VSSA) U6.23(VSS) U6.35(VSS) U6.47(VSS)
VDD: C38.2 C39.2 C40.2 C41.2 C42.2 C43.2 C44.2 C45.2 C46.2 C47.2 J4.03 U6.1(VBAT) U6.20(VREF+) U6.21(VDDA) U6.24(VDD) U6.36(VDD) U6.48(VDD)  [also labelled 3V3, VDDA, VREF+]
BOOT: R17.2 U6.45(PB8-BOOT0)
CAN_RX_LED: U6.25(PB11) ; port CAN_RX_LED
CAN_STB: U6.42(PB5) ; port CAN_STB
CAN_TX_LED: U6.26(PB12) ; port CAN_TX_LED
CS: U6.8(PA0) ; port CS
FDCAN_RX: U6.33(PA11) ; port FDCAN_RX
FDCAN_TX: U6.34(PA12) ; port FDCAN_TX
LIMIT_A: J5.4 U6.2(PC13)
LIMIT_B: J5.3 U6.3(PC14)
MOTOR_DIR: U6.27(PB13) ; port MOTOR_DIR
MOTOR_PWM: U6.30(PA8) ; port MOTOR_PWM
NRST: C48.1 J4.12 U6.7(PG10)
QUAD_A: J3.4 U6.43(PB6)
QUAD_B: J3.3 U6.44(PB7)
STLINK_RX: J4.13 U6.11(PA3)
STLINK_TX: J4.14 U6.10(PA2)
SWCLK: J4.06 U6.38(PA14-SWCLK)
SWDIO: J4.04 U6.37(PA13-SWDIO)
SWO: J4.08 U6.40(PB3)

Not connected (* = marked no-connect by the designer): J4 01* 02* 09* 10*; U6 4(PC15)* 5(PF0)* 6(PF1)* 9(PA1)* 12(PA4)* 13(PA5)* 14(PA6)* 15(PA7)* 16(PB0)* 17(PB1)* 18(PB2)* 22(PB10)* 28(PB14)* 29(PB15)* 31(PA9)* 32(PA10)* 39(PA15)* 41(PB4)* 46(PB9)

### Notes on the sheet
- Power Filtering
- Quad Encoder
- Flashing
- (near J5) Limit Switch
- MCU

### Library data of the parts
J3 J5 = CONN MF+ 4 PIN Right Angle Square: Micro-Fit+ Right-Angle Header, Through Hole, 3.00mm Pitch, Dual Row, 4 Circuits, 1.52Âµm Matte Tin (Sn) Plating, Glow-Wire Capable, Black; Manufacturer_Name: Molex Connector Corporation; Copyright: Copyright (C) 2026 Ultra Librarian. All rights reserved.; Manufacturer_Part_Number: 2125280400; RefDes: RefDes; Type: Type
J4 = CONN_Flashing-0001: Connector Header Surface Mount 14 position 0.050" (1.27mm); MF: Samtec; Value: *; Price: None; Package: None; Availability: Unavailable; MP: FTSH-107-01-L-DV-K; ComponentLink1Description: Datasheet; ComponentLink1URL: https://mm.digikey.com/Volume0/opasdata/d220001/medias/docus/6209/ftsh-1xx-xx-xxx-dv-xxx-xxx-x-xx-mkt.pdf
R17 = RES-0-0001: 0 Ohms Jumper Chip Resistor 2010 (5025 Metric) Automotive AEC-Q200 Metal Element; Tolerance: 1%; Size: 0402; ComponentLink1Description: Datasheet; ComponentLink1URL: https://www.yageo.com/upload/media/product/products/datasheet/rchip/PYu-RC_Group_51_RoHS_L_12.pdf
U6 = IC-STM32G431CBT6: IC MCU 32BIT 128KB FLASH 48LQFP; Package: 48LQFP; ComponentLink1Description: Datasheet; ComponentLink1URL: https://www.st.com/resource/en/datasheet/stm32g431cb.pdf

## Sheet CAN.SchDoc
size A; SheetNumber: 5; SheetTotal: 5
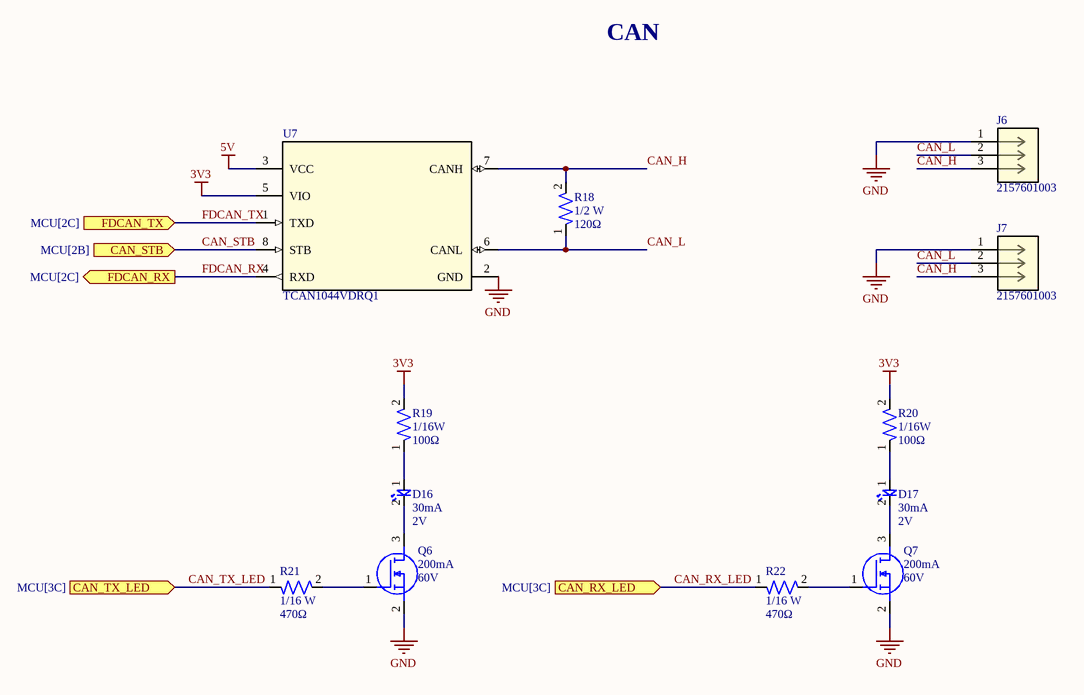
[diagram p6: CAN.SchDoc]

### Parts
D16  Forward Current: 30mA  Forward Voltage: 2V  [LED-0603]  (hidden comment: BL-HKC36G-AV-TRB)
D17  Forward Current: 30mA  Forward Voltage: 2V  [LED-0603]  (hidden comment: BL-HKC36G-AV-TRB)
J6  2157601003  [CONN_2157600003-SD_03_PEG_MOL]
J7  2157601003  [CONN_2157600003-SD_03_PEG_MOL]
Q6  Continuous Current: 200mA  Voltage: 60V  [IC-SOT23-3]  (hidden comment: T2N7002AK,LM)
Q7  Continuous Current: 200mA  Voltage: 60V  [IC-SOT23-3]  (hidden comment: T2N7002AK,LM)
R18  Wattage: 1/2 W  Resistance: 120Ω  [RES-1210]  (hidden comment: RC1210FR-07120RL)
R19  Wattage: 1/16W  Resistance: 100Ω  [RES-0805]  (hidden comment: RES 0805)
R20  Wattage: 1/16W  Resistance: 100Ω  [RES-0805]  (hidden comment: RES 0805)
R21  Wattage: 1/16 W  Resistance: 470Ω  [RES-0805]  (hidden comment: RES 0805)
R22  Wattage: 1/16 W  Resistance: 470Ω  [RES-0805]  (hidden comment: RES 0805)
U7  TCAN1044VDRQ1  [IC-8SOIC]

### Ports
CAN_RX_LED (in, see MCU[3C]), CAN_STB (in, see MCU[2B]), CAN_TX_LED (in, see MCU[3C]), FDCAN_RX (out, see MCU[2C]), FDCAN_TX (in, see MCU[2C])

### Nets
3V3: R19.2 R20.2 U7.5(VIO)  [project net VDD]
5V: U7.3(VCC)
GND: J6.1 J7.1 Q6.2(S) Q7.2(S) U7.2(GND)
CAN_H: J6.3 J7.3 R18.2 U7.7(CANH)
CAN_L: J6.2 J7.2 R18.1 U7.6(CANL)
CAN_RX_LED: R22.1 ; port CAN_RX_LED
CAN_STB: U7.8(STB) ; port CAN_STB
CAN_TX_LED: R21.1 ; port CAN_TX_LED
FDCAN_RX: U7.4(RXD) ; port FDCAN_RX
FDCAN_TX: U7.1(TXD) ; port FDCAN_TX
NetD16_1: D16.1 R19.1
NetD16_2: D16.2 Q6.3(D)
NetD17_1: D17.1 R20.1
NetD17_2: D17.2 Q7.3(D)
NetQ6_1: Q6.1(G) R21.2
NetQ7_1: Q7.1(G) R22.2

### Notes on the sheet
- CAN

### Library data of the parts
D16 D17 = LED-0001: LED YELLOW CLEAR 0603 SMD; ComponentLink1Description: Datasheet; ComponentLink1URL: https://www.americanbrightled.com/pdffiles/led-components/smt/BL-HKC36G-AV-TRB.pdf
J6 J7 = CONN MF+ 3 PIN Right Angle: Micro-Fit+ Right-Angle Header, Through Hole, 3.00mm Pitch, Single Row, 3  Circuits, Matte Tin (Sn) Plating, Glow-Wire Capable, Black; Manufacturer_Name: Molex; Copyright: Copyright (C) 2026 Ultra Librarian. All rights reserved.; Manufacturer_Part_Number: 2157601003; Datasheet: https://www.molex.com/en-us/products/part-detail-pdf/2157601003?display=pdf; RefDes: RefDes; Type: Type
Q6 Q7 = NMOS-200MA-0001: MOSFET N-CH 60V 200MA SOT23; ComponentLink1Description: Datasheet; ComponentLink1URL: https://toshiba.semicon-storage.com/info/T2N7002AK_datasheet_en_20150401.pdf?did=29712&prodName=T2N7002AK
R18 = RES CAN TERM 1210
U7 = IC-CAN-0001: IC TRANSCEIVER 1/1 8SOIC; ComponentLink1Description: Datasheet; ComponentLink1URL: https://www.ti.com/lit/ds/symlink/tcan1044-q1.pdf?HQS=dis-dk-null-digikeymode-dsf-pf-null-wwe&ts=1728758303289&ref_url=https%253A%252F%252Fwww.ti.com%252Fgeneral%252Fdocs%252Fsuppproductinfo.tsp%253FdistId%253D10%2526gotoUrl%253Dhttps%253A%252F%252Fwww.ti.com%252Flit%252Fgpn%252Ftcan1044-q1

## Nets that join several sheets
5V: LDOs (7 pins), MCU (J3.1), CAN (U7.3)
12V: Motor Control (8 pins), 12V Buck (D?#2.2 L?#1.2 R?#1.2 R?#5.2), 7V Buck (D?#5.2 L?#2.2 R?#17.2 R?#21.2)
GND: Input Power (11 pins), Motor Control (41 pins), 12V Buck (5 pins), 7V Buck (5 pins), LDOs (12 pins), MCU (22 pins), CAN (5 pins)
VBAT_FUSED_12: Input Power (F1.2), 12V Buck (Q?#1.5 R?#3.2 R?#4.2), 7V Buck (Q?#3.5 R?#19.2 R?#20.2)
VDD: Motor Control (U3.5 U3.6), LDOs (7 pins), MCU (17 pins), CAN (R19.2 R20.2 U7.5)
CAN_RX_LED: MCU (U6.25), CAN (R22.1)
CAN_STB: MCU (U6.42), CAN (U7.8)
CAN_TX_LED: MCU (U6.26), CAN (R21.1)
CS: Motor Control (C27.2 R13.2), MCU (U6.8)
FDCAN_RX: MCU (U6.33), CAN (U7.4)
FDCAN_TX: MCU (U6.34), CAN (U7.1)
MOTOR_DIR: Motor Control (U4.6 U5.6), MCU (U6.27)
MOTOR_PWM: Motor Control (U4.2 U5.2), MCU (U6.30)